# Altium schematic sheet Connector Array.SchDoc
size A2; SheetNumber: 2; SheetTotal: 3
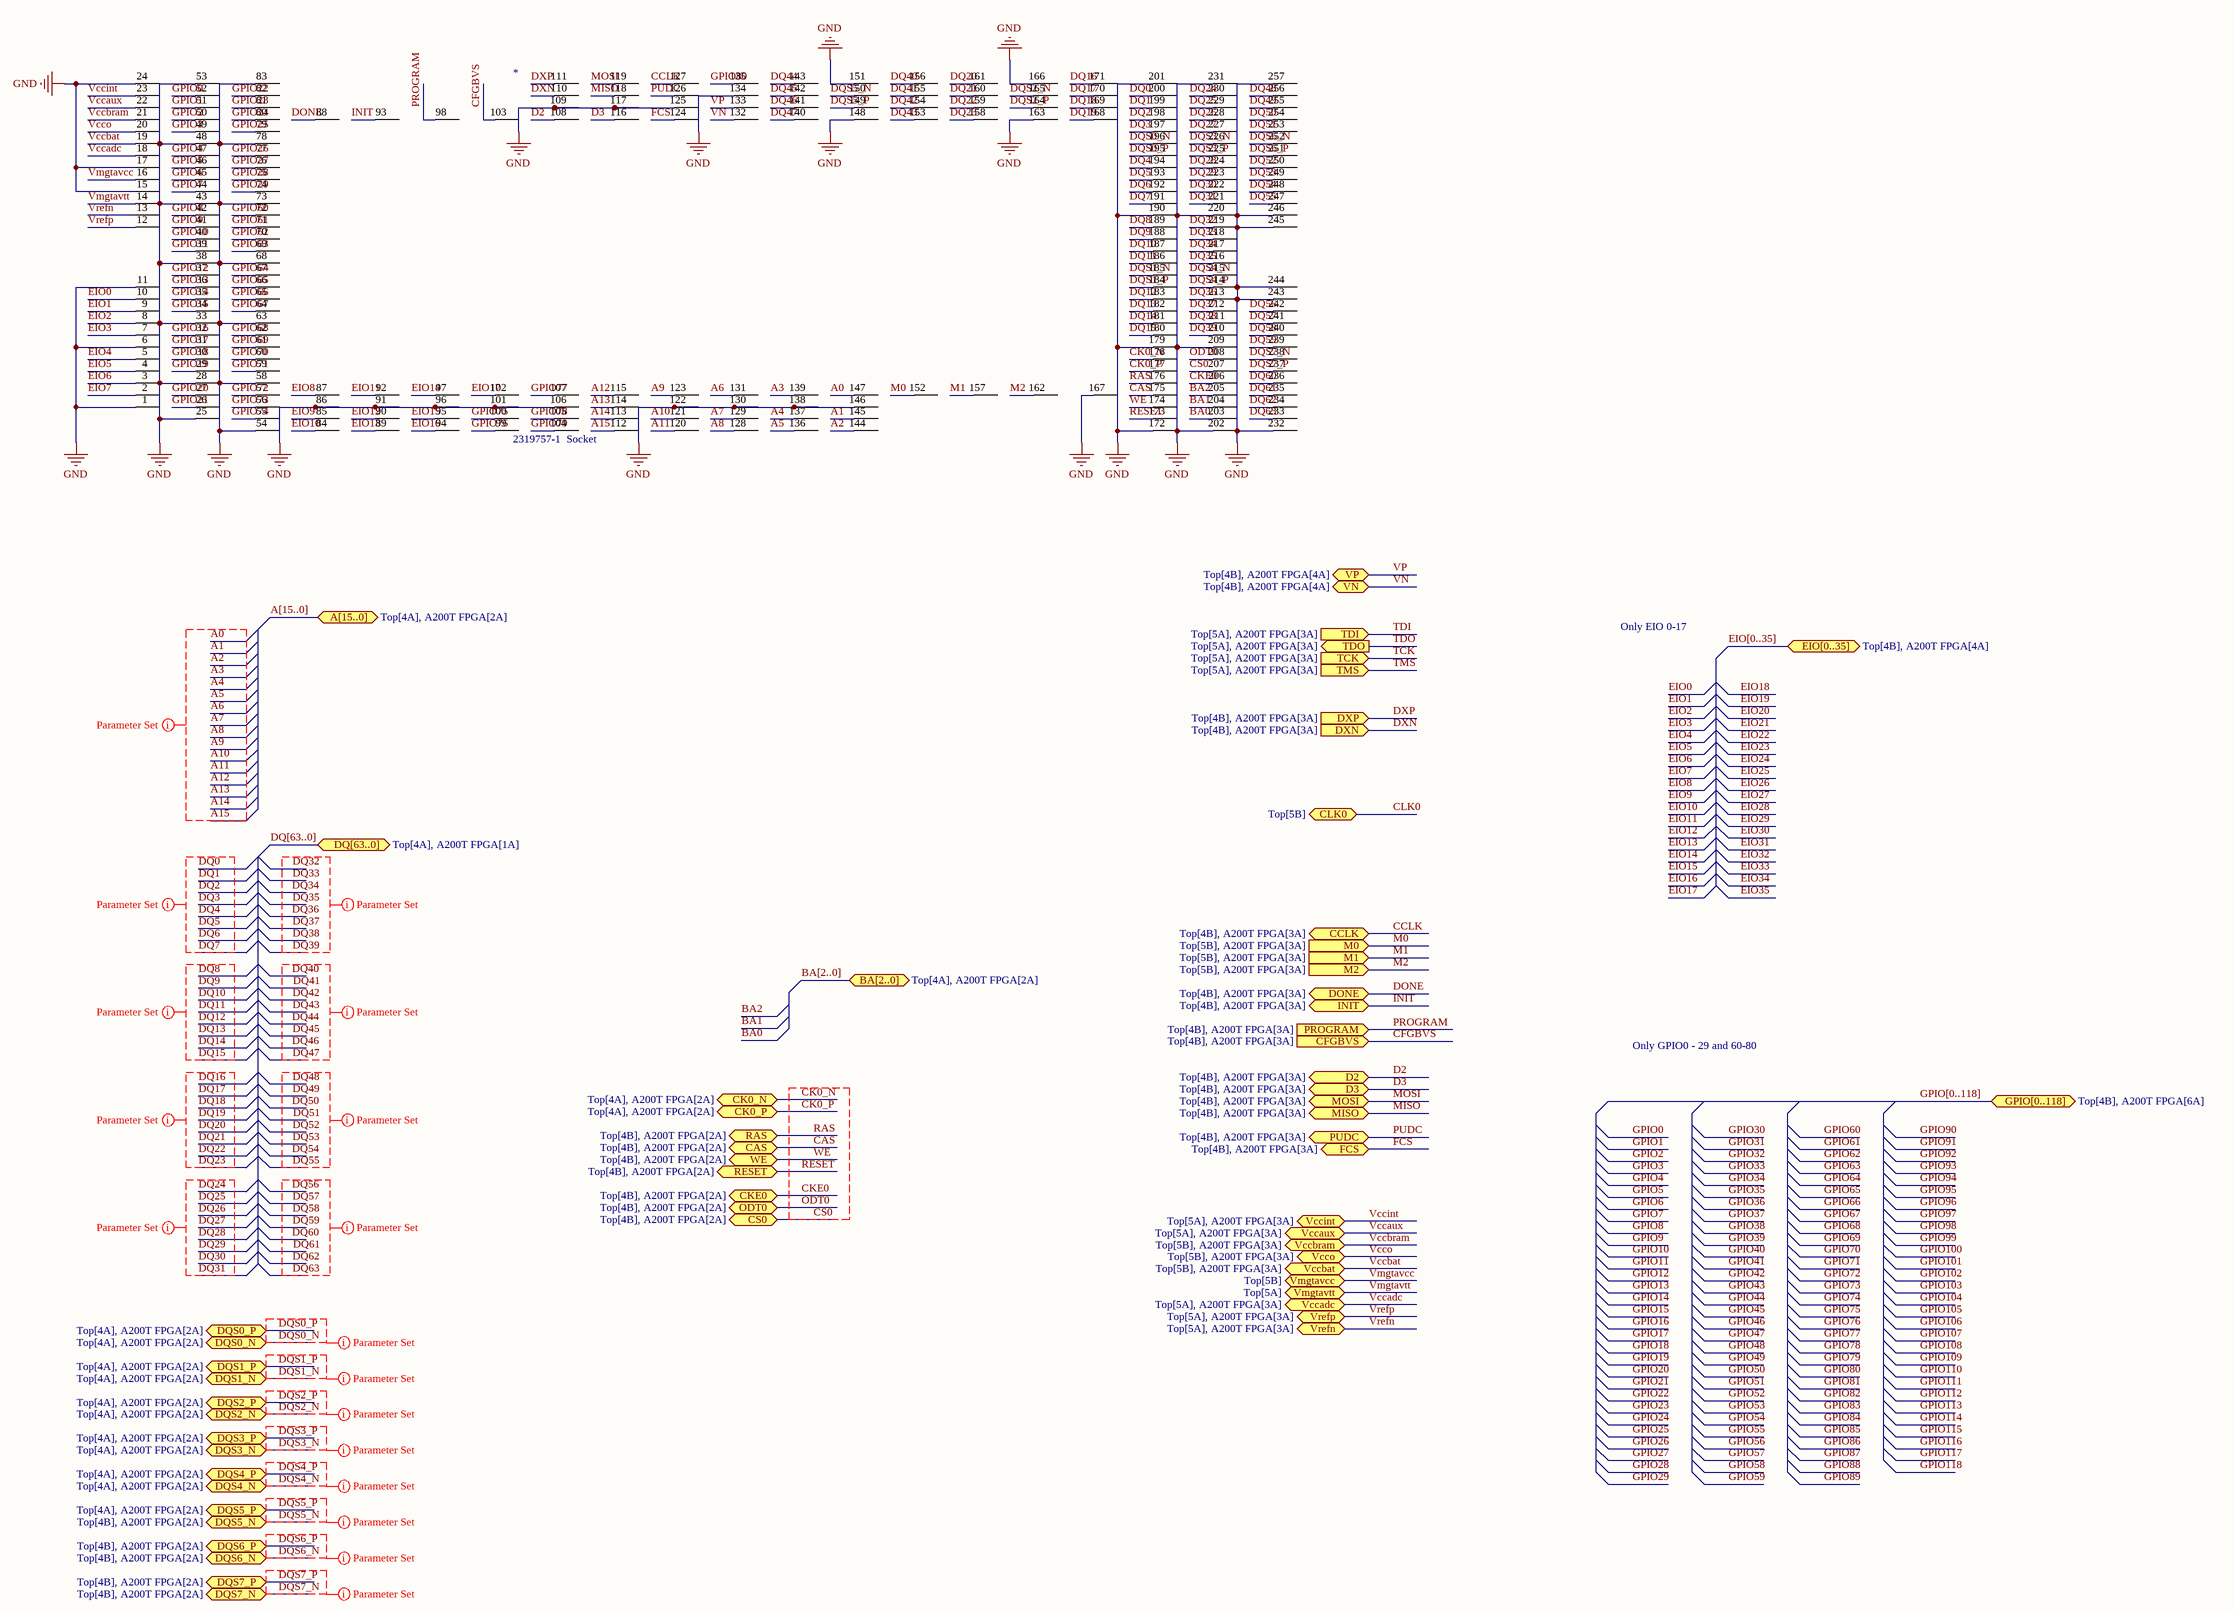
[diagram p0: Connector Array.SchDoc]

## Parts
*  2319757-1  Socket  [2319757-1  LGA Socket]

## Ports
A[15..0] (bidir, see Top[4A], A200T FPGA[2A]), BA[2..0] (bidir, see Top[4A], A200T FPGA[2A]), CAS (bidir, see Top[4B], A200T FPGA[2A]), CCLK (bidir, see Top[4B], A200T FPGA[3A]), CFGBVS (in, see Top[4B], A200T FPGA[3A]), CK0_N (bidir, see Top[4A], A200T FPGA[2A]), CK0_P (bidir, see Top[4A], A200T FPGA[2A]), CKE0 (bidir, see Top[4B], A200T FPGA[2A]), CLK0 (bidir, see Top[5B]), CS0 (bidir, see Top[4B], A200T FPGA[2A]), D2 (bidir, see Top[4B], A200T FPGA[3A]), D3 (bidir, see Top[4B], A200T FPGA[3A]), DONE (bidir, see Top[4B], A200T FPGA[3A]), DQ[63..0] (bidir, see Top[4A], A200T FPGA[1A]), DQS0_N (bidir, see Top[4A], A200T FPGA[2A]), DQS0_P (bidir, see Top[4A], A200T FPGA[2A]), DQS1_N (bidir, see Top[4A], A200T FPGA[2A]), DQS1_P (bidir, see Top[4A], A200T FPGA[2A]), DQS2_N (bidir, see Top[4A], A200T FPGA[2A]), DQS2_P (bidir, see Top[4A], A200T FPGA[2A]), DQS3_N (bidir, see Top[4A], A200T FPGA[2A]), DQS3_P (bidir, see Top[4A], A200T FPGA[2A]), DQS4_N (bidir, see Top[4A], A200T FPGA[2A]), DQS4_P (bidir, see Top[4A], A200T FPGA[2A]), DQS5_N (bidir, see Top[4B], A200T FPGA[2A]), DQS5_P (bidir, see Top[4A], A200T FPGA[2A]), DQS6_N (bidir, see Top[4B], A200T FPGA[2A]), DQS6_P (bidir, see Top[4B], A200T FPGA[2A]), DQS7_N (bidir, see Top[4B], A200T FPGA[2A]), DQS7_P (bidir, see Top[4B], A200T FPGA[2A]), DXN (in, see Top[4B], A200T FPGA[3A]), DXP (in, see Top[4B], A200T FPGA[3A]), EIO[0..35] (bidir, see Top[4B], A200T FPGA[4A]), FCS (bidir, see Top[4B], A200T FPGA[3A]), GPIO[0..118] (bidir, see Top[4B], A200T FPGA[6A]), INIT (bidir, see Top[4B], A200T FPGA[3A]), M0 (in, see Top[5B], A200T FPGA[3A]), M1 (in, see Top[5B], A200T FPGA[3A]), M2 (in, see Top[5B], A200T FPGA[3A]), MISO (bidir, see Top[4B], A200T FPGA[3A]), MOSI (bidir, see Top[4B], A200T FPGA[3A]), ODT0 (bidir, see Top[4B], A200T FPGA[2A]), PROGRAM (in, see Top[4B], A200T FPGA[3A]), PUDC (bidir, see Top[4B], A200T FPGA[3A]), RAS (bidir, see Top[4B], A200T FPGA[2A]), RESET (bidir, see Top[4B], A200T FPGA[2A]), TCK (in, see Top[5A], A200T FPGA[3A]), TDI (in, see Top[5A], A200T FPGA[3A]), TDO (out, see Top[5A], A200T FPGA[3A]), TMS (in, see Top[5A], A200T FPGA[3A]), Vccadc (bidir, see Top[5A], A200T FPGA[3A]), Vccaux (bidir, see Top[5A], A200T FPGA[3A]), Vccbat (bidir, see Top[5B], A200T FPGA[3A]), Vccbram (bidir, see Top[5B], A200T FPGA[3A]), Vccint (bidir, see Top[5A], A200T FPGA[3A]), Vcco (bidir, see Top[5B], A200T FPGA[3A]), Vmgtavcc (bidir, see Top[5B]), Vmgtavtt (bidir, see Top[5A]), VN (bidir, see Top[4B], A200T FPGA[4A]), VP (bidir, see Top[4B], A200T FPGA[4A]), Vrefn (bidir, see Top[5A], A200T FPGA[3A]), Vrefp (bidir, see Top[5A], A200T FPGA[3A]), WE (bidir, see Top[4B], A200T FPGA[2A])

## Nets
GND: *.1 *.6 *.11 *.15 *.17 *.24 *.25 *.28 *.33 *.38 *.43 *.48 *.53 *.54 *.58 *.63 *.68 *.73 *.78 *.83 *.86 *.91 *.96 *.101 *.106 *.109 *.117 *.122 *.125 *.130 *.134 *.138 *.146 *.148 *.151 *.163 *.166 *.167 *.172 *.179 *.190 *.201 *.202 *.209 *.220 *.231 *.232 *.243 *.244 *.245 *.246 *.257
A0: *.147
A1: *.145
A2: *.144
A3: *.139
A4: *.137
A5: *.136
A6: *.131
A7: *.129
A8: *.128
A9: *.123
A10: *.121
A11: *.120
A12: *.115
A13: *.114
A14: *.113
A15: *.112
BA0: *.203
BA1: *.204
BA2: *.205
CAS: *.175 ; port CAS
CCLK: *.127 ; port CCLK
CFGBVS: *.103 ; port CFGBVS
CK0_N: *.178 ; port CK0_N
CK0_P: *.177 ; port CK0_P
CKE0: *.206 ; port CKE0
CLK0: port CLK0
CS0: *.207 ; port CS0
D2: *.108 ; port D2
D3: *.116 ; port D3
DONE: *.88 ; port DONE
DQ0: *.200
DQ1: *.199
DQ2: *.198
DQ3: *.197
DQ4: *.194
DQ5: *.193
DQ6: *.192
DQ7: *.191
DQ8: *.189
DQ9: *.188
DQ10: *.187
DQ11: *.186
DQ12: *.183
DQ13: *.182
DQ14: *.181
DQ15: *.180
DQ16: *.171
DQ17: *.170
DQ18: *.169
DQ19: *.168
DQ20: *.161
DQ21: *.160
DQ22: *.159
DQ23: *.158
DQ24: *.230
DQ25: *.229
DQ26: *.228
DQ27: *.227
DQ28: *.224
DQ29: *.223
DQ30: *.222
DQ31: *.221
DQ32: *.219
DQ33: *.218
DQ34: *.217
DQ35: *.216
DQ36: *.213
DQ37: *.212
DQ38: *.211
DQ39: *.210
DQ40: *.156
DQ41: *.155
DQ42: *.154
DQ43: *.153
DQ44: *.143
DQ45: *.142
DQ46: *.141
DQ47: *.140
DQ48: *.256
DQ49: *.255
DQ50: *.254
DQ51: *.253
DQ52: *.250
DQ53: *.249
DQ54: *.248
DQ55: *.247
DQ56: *.242
DQ57: *.241
DQ58: *.240
DQ59: *.239
DQ60: *.236
DQ61: *.235
DQ62: *.234
DQ63: *.233
DQS0_N: *.196 ; port DQS0_N
DQS0_P: *.195 ; port DQS0_P
DQS1_N: *.185 ; port DQS1_N
DQS1_P: *.184 ; port DQS1_P
DQS2_N: *.165 ; port DQS2_N
DQS2_P: *.164 ; port DQS2_P
DQS3_N: *.226 ; port DQS3_N
DQS3_P: *.225 ; port DQS3_P
DQS4_N: *.215 ; port DQS4_N
DQS4_P: *.214 ; port DQS4_P
DQS5_N: *.150 ; port DQS5_N
DQS5_P: *.149 ; port DQS5_P
DQS6_N: *.252 ; port DQS6_N
DQS6_P: *.251 ; port DQS6_P
DQS7_N: *.238 ; port DQS7_N
DQS7_P: *.237 ; port DQS7_P
DXN: *.110 ; port DXN
DXP: *.111 ; port DXP
EIO0: *.10
EIO1: *.9
EIO2: *.8
EIO3: *.7
EIO4: *.5
EIO5: *.4
EIO6: *.3
EIO7: *.2
EIO8: *.87
EIO9: *.85
EIO10: *.84
EIO11: *.92
EIO12: *.90
EIO13: *.89
EIO14: *.97
EIO15: *.95
EIO16: *.94
EIO17: *.102
FCS: *.124 ; port FCS
GPIO0: *.52
GPIO1: *.51
GPIO2: *.50
GPIO3: *.49
GPIO4: *.47
GPIO5: *.46
GPIO6: *.45
GPIO7: *.44
GPIO8: *.42
GPIO9: *.41
GPIO10: *.40
GPIO11: *.39
GPIO12: *.37
GPIO13: *.36
GPIO14: *.35
GPIO15: *.34
GPIO16: *.32
GPIO17: *.31
GPIO18: *.30
GPIO19: *.29
GPIO20: *.27
GPIO21: *.26
GPIO22: *.82
GPIO23: *.81
GPIO24: *.80
GPIO25: *.79
GPIO26: *.77
GPIO27: *.76
GPIO28: *.75
GPIO29: *.74
GPIO60: *.72
GPIO61: *.71
GPIO62: *.70
GPIO63: *.69
GPIO64: *.67
GPIO65: *.66
GPIO66: *.65
GPIO67: *.64
GPIO68: *.62
GPIO69: *.61
GPIO70: *.60
GPIO71: *.59
GPIO72: *.57
GPIO73: *.56
GPIO74: *.55
GPIO75: *.100
GPIO76: *.99
GPIO77: *.107
GPIO78: *.105
GPIO79: *.104
GPIO80: *.135
INIT: *.93 ; port INIT
M0: *.152 ; port M0
M1: *.157 ; port M1
M2: *.162 ; port M2
MISO: *.118 ; port MISO
MOSI: *.119 ; port MOSI
ODT0: *.208 ; port ODT0
PROGRAM: *.98 ; port PROGRAM
PUDC: *.126 ; port PUDC
RAS: *.176 ; port RAS
RESET: *.173 ; port RESET
TCK: port TCK
TDI: port TDI
TDO: port TDO
TMS: port TMS
Vccadc: *.18 ; port Vccadc
Vccaux: *.22 ; port Vccaux
Vccbat: *.19 ; port Vccbat
Vccbram: *.21 ; port Vccbram
Vccint: *.23 ; port Vccint
Vcco: *.20 ; port Vcco
Vmgtavcc: *.16 ; port Vmgtavcc
Vmgtavtt: *.14 ; port Vmgtavtt
VN: *.132 ; port VN
VP: *.133 ; port VP
Vrefn: *.13 ; port Vrefn
Vrefp: *.12 ; port Vrefp
WE: *.174 ; port WE

## Buses and harness runs
bus A[15..0] = port A[15..0]
bus BA[2..0] = port BA[2..0]
bus DQ[63..0] = port DQ[63..0]
bus EIO[0..35] = port EIO[0..35]
bus GPIO[0..118] = port GPIO[0..118]

## Layout directives
net class DG_0: DQ0, DQ1, DQ2, DQ3, DQ4, DQ5, DQ6, DQ7, DQS0_N, DQS0_P
net class DG_1: DQ8, DQ9, DQ10, DQ11, DQ12, DQ13, DQ14, DQ15, DQS1_N, DQS1_P
net class DG_2: DQ16, DQ17, DQ18, DQ19, DQ20, DQ21, DQ22, DQ23, DQS2_N, DQS2_P
net class DG_3: DQ24, DQ25, DQ26, DQ27, DQ28, DQ29, DQ30, DQ31, DQS3_N, DQS3_P
net class DG_7: DQ56, DQ57, DQ58, DQ59, DQ60, DQ61, DQ62, DQ63, DQS7_N, DQS7_P
net class DG_6: DQ48, DQ49, DQ50, DQ51, DQ52, DQ53, DQ54, DQ55, DQS6_N, DQS6_P
net class DG_5: DQ40, DQ41, DQ42, DQ43, DQ44, DQ45, DQ46, DQ47, DQS5_N, DQS5_P
net class DG_4: DQ32, DQ33, DQ34, DQ35, DQ36, DQ37, DQ38, DQ39, DQS4_N, DQS4_P
net class CG: A0, A1, A2, A3, A4, A5, A6, A7, A8, A9, A10, A11, A12, A13, A14, A15

## Notes on the sheet
- Only EIO 0-17
- Only GPIO0 - 29 and 60-80